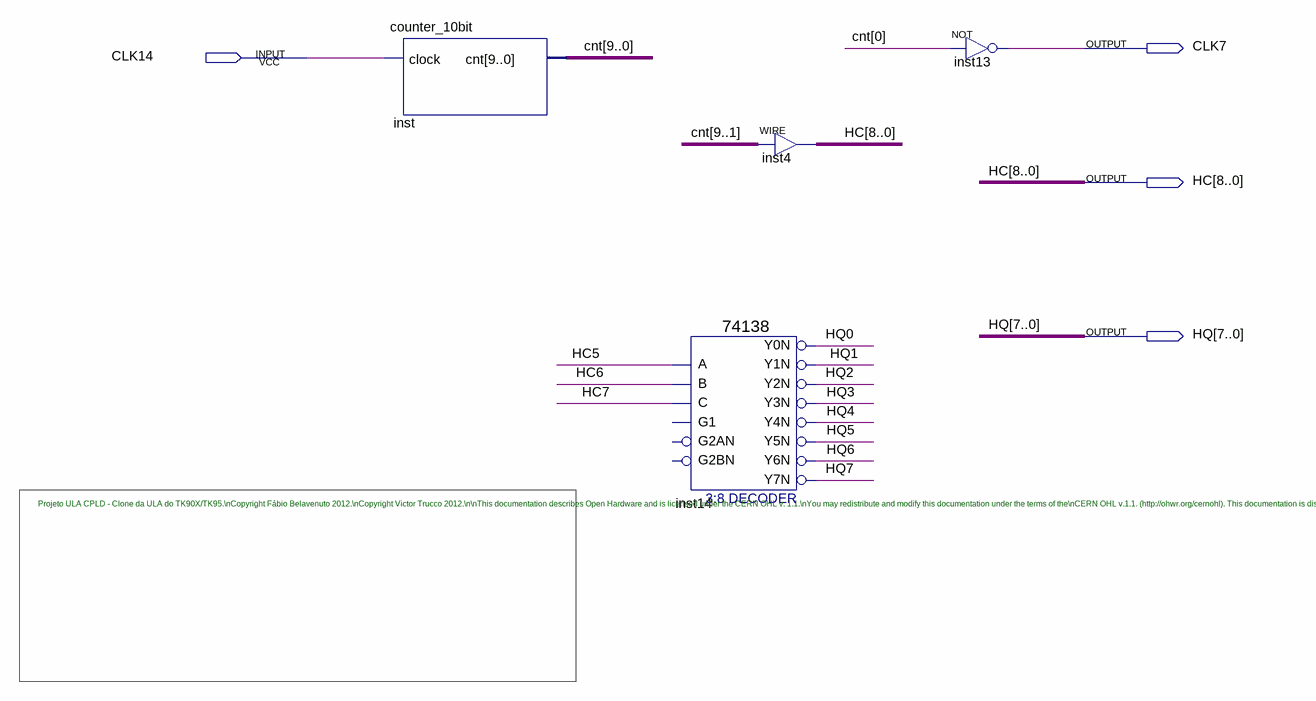
[diagram p0: schematic sheet]
// Quartus schematic clock.bdf as structural Verilog: 4 symbols, 4 pins
module clock (
  input  CLK14,
  output CLK7,
  output [8:0] HC,
  output [7:0] HQ
);

  wire [9:0] cnt;

  counter_10bit inst (.clock(CLK14), .cnt(cnt));
  \74138  inst14 (
    .A(HC[5]), .B(HC[6]), .C(HC[7]), .Y0N(HQ[0]), .Y1N(HQ[1]), .Y2N(HQ[2]), .Y3N(HQ[3]), .Y4N(HQ[4]),
    .Y5N(HQ[5]), .Y6N(HQ[6]), .Y7N(HQ[7]));  // open: G1, G2AN, G2BN
  assign HC = cnt[9:1];  // WIRE inst4
  not inst13 (CLK7, cnt[0]);

  // Notes on the sheet:
  //   Projeto ULA CPLD - Clone da ULA do TK90X/TK95.\nCopyright Fábio Belavenuto 2012.\nCopyright Victor Trucco 2012.\n\nThis documentation describes Open Hardware and is licensed under the CERN OHL v. 1.1.\nYou may redistribute and modify this documentation under the terms of the\nCERN OHL v.1.1. (http://ohwr.org/cernohl). This documentation is distributed\nWITHOUT ANY EXPRESS OR IMPLIED WARRANTY, INCLUDING OF MERCHANTABILITY,\nSATISFACTORY QUALITY AND FITNESS FOR A PARTICULAR PURPOSE.\nPlease see the CERN OHL v.1.1 for applicable conditions
endmodule
